# EAGLE design GBP USB-C Charging Kit (EAGLE 6.2)
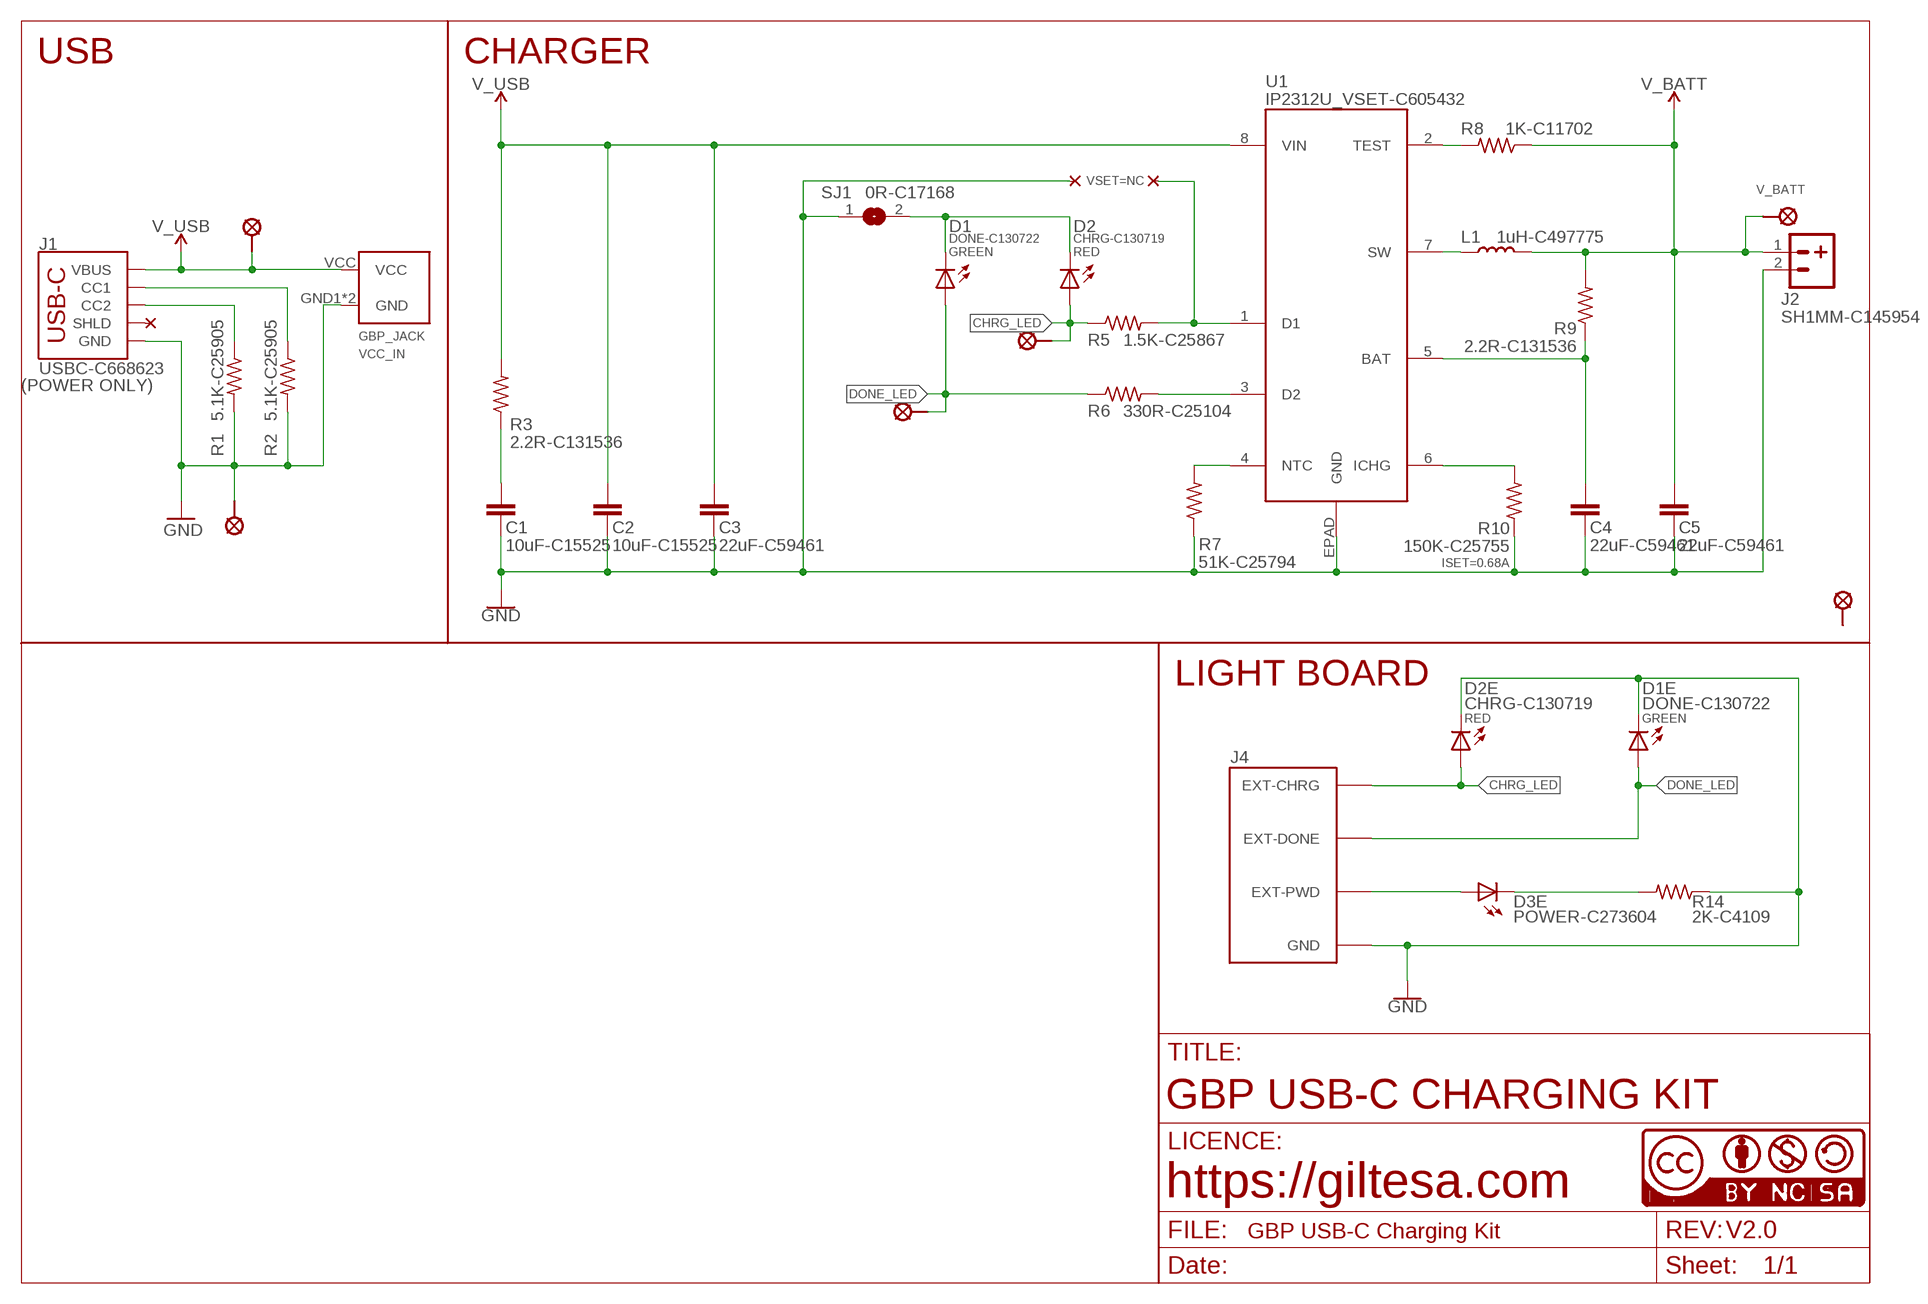
[diagram p0: schematic, sheet 1]

## Parts
C1  10uF-C15525  C0402_S  [C0402_S]
C2  10uF-C15525  C0402_S  [C0402_S]
C3  22uF-C59461  C0603_SMALL  [C0603_S]
C4  22uF-C59461  C0603_SMALL  [C0603_S]
C5  22uF-C59461  C0603_SMALL  [C0603_S]
D1  DONE-C130722  LED_0402  [L0402]
D1E  DONE-C130722  LED_0402  [L0402]
D2  CHRG-C130719  LED_0402  [L0402]
D2E  CHRG-C130719  LED_0402  [L0402]
D3E  POWER-C273604  LED_0402  [L0402]
GBP_JACK  VCC_IN  GBP_POWER_JACK_DIP  [GBP_POWER_JACK_DIP]
J1  USBC-C668623  USB-C_6P_POWER  [USB-C_6P]
J2  SH1MM-C145954  JST-21MM  [JST-2-1MM-SMD_RIGHT]
J4  GBP_LED_V2  [GBP_LED_V2]
L1  1uH-C497775  INDUCTOR_2  [PSPMAA0402]
R1  5.1K-C25905  R0402  [R0402]
R2  5.1K-C25905  R0402  [R0402]
R3  2.2R-C131536  R0402  [R0402]
R5  1.5K-C25867  R0402  [R0402]
R6  330R-C25104  R0402  [R0402]
R7  51K-C25794  R0402  [R0402]
R8  1K-C11702  R0402  [R0402]
R9  2.2R-C131536  R0402  [R0402]
R10  150K-C25755  R0402  [R0402]
R14  2K-C4109  R0402  [R0402]
SJ1  0R-C17168  JUMPER-SMD0402  [JUMPER-SMD_0402]
U1  IP2312U_VSET-C605432  IP2312_CUSTOM  [IP2312]
U$1  V_BATT  PAD_1.25  [PAD_1.25]
U$2  SOLDER_PAD-2.0  [SOLDER_PAD_2.0]
U$12  PAD_2.0  [PAD_2.0]
U$17  CC-NC-BCNIX  [CC-NC-B_NIX]
U$24  CHRG_LED  SOLDER_PAD-1.3  [SOLDER_PAD_1.3]
U$25  DONE_LED  SOLDER_PAD-1.3  [SOLDER_PAD_1.3]
U$41  PAD_1.25  [PAD_1.25]

## Nets
CHRG_LED: D2.A D2E.A J4.EXT-CHRG R5.1 U$24.P$1
DONE_LED: D1.A D1E.A J4.EXT-DONE R6.1 U$25.P$1
GND: C1.1 C2.1 C3.1 C4.1 C5.1 D1E.C D2E.C GBP_JACK.GND1(GND) GBP_JACK.GND2(GND) J1.A12-GND(GND) J1.B12-GND(GND) J2.2 J4.GND R1.2 R2.2 R7.1 R10.1 R14.1 SJ1.1 U1.EPAD(GND) U$12.P$1
N$1: D1.C D2.C SJ1.2
N$4: J1.B5(CC2) R1.1
N$6: R8.2 U1.2(TEST)
N$10: D3E.A J4.EXT-PWD J4.EXT-PWD'(EXT-PWD)
N$11: D3E.C R14.2
N$13: J1.A5(CC1) R2.1
N$14: C4.2 R9.1 U1.5(BAT)
N$15: C1.2 R3.1
N$19: R5.2 U1.1(D1)
N$27: R7.2 U1.4(NTC)
N$28: R10.2 U1.6(ICHG)
N$29: R6.2 U1.3(D2)
N$31: L1.P$1 U1.7(SW)
V_BATT: C5.2 J2.1 L1.P$2 R8.1 R9.2 U$1.P$1
V_USB: C2.2 C3.2 GBP_JACK.VCC J1.A9-VBUS(VBUS) J1.B9-VBUS(VBUS) R3.2 U1.8(VIN) U$41.P$1
Unconnected: J1.SHLD1(SHLD) J1.SHLD2(SHLD) J1.SHLD3(SHLD) J1.SHLD4(SHLD) U$2.P$1

## Notes on the sheet
- USB | CHARGER
- VSET=NC
- GREEN | RED
- (POWER ONLY)
- ISET=0.68A
- LIGHT BOARD
- RED | GREEN
- GBP USB-C CHARGING KIT
- https://giltesa.com
- V2.0

## Library data of the parts
C1 C2 = ,giltesa:C0402
C3-C5 = ,giltesa:C0603
D1 D1E D2 D2E D3E = ,giltesa:LED
GBP_JACK = ,giltesa:GBP_POWER_JACK
J1 = ,giltesa:USB-C_6P
J2 = ,giltesa:JST-2
J4 = ,giltesa:GBP_LED_V2
L1 = ,giltesa:INDUCTOR
R1-R3 R5-R10 R14 = ,giltesa:R0402
SJ1 = ,giltesa:JUMPER-SMD
U1 = ,giltesa:IP2312
U$1 U$12 U$41 = ,giltesa:PAD
U$2 U$24 U$25 = ,giltesa:SOLDER_PAD
U$17 = cc-by-nc-sa:CC-NC-BC: All hardware is licensed under the Creative Commons Attribution-Noncommercial-Share Alike 2.5 Switzerland License. To view a copy of this license, visit http://creativecommons.org/licenses/by-nc-sa/2.5/ch/ or send a letter to Creative Commons, 171 Second Street, Suite 300, San Francisco, California, 94105, USA.

## Net classes
1 power: width 0.61 mm, drill 0.406 mm, clearance 0.203 mm
2 gnd: width 0.305 mm, drill 0.406 mm, clearance 0.203 mm
3 power usb: width 0.508 mm, drill 0.406 mm, clearance 0.203 mm

## Board
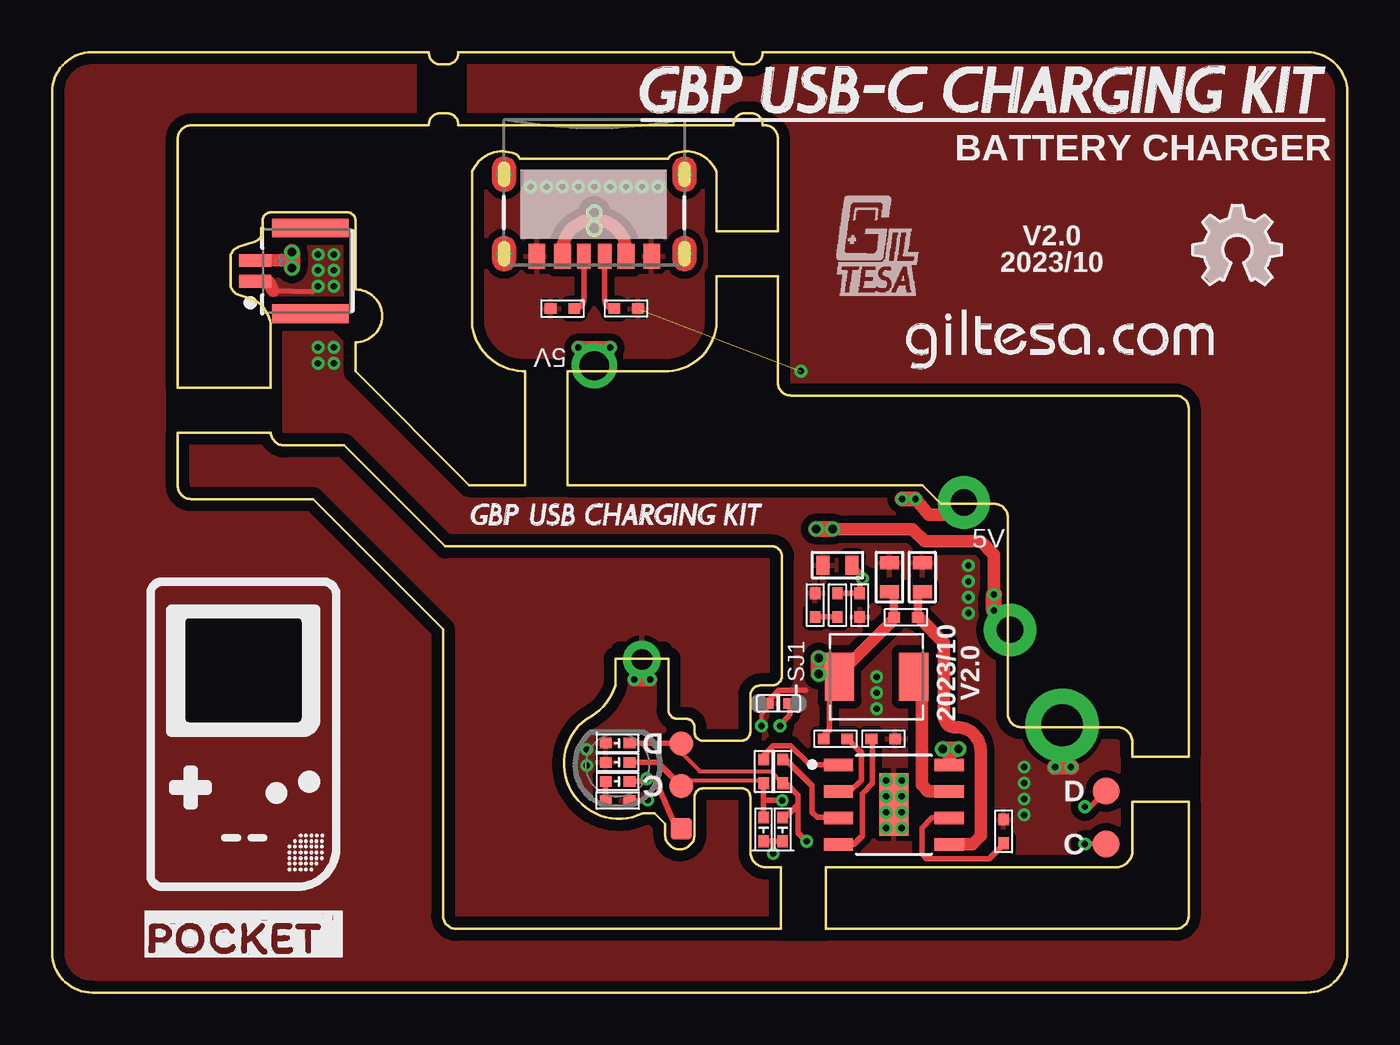
[diagram p1: board, top side]
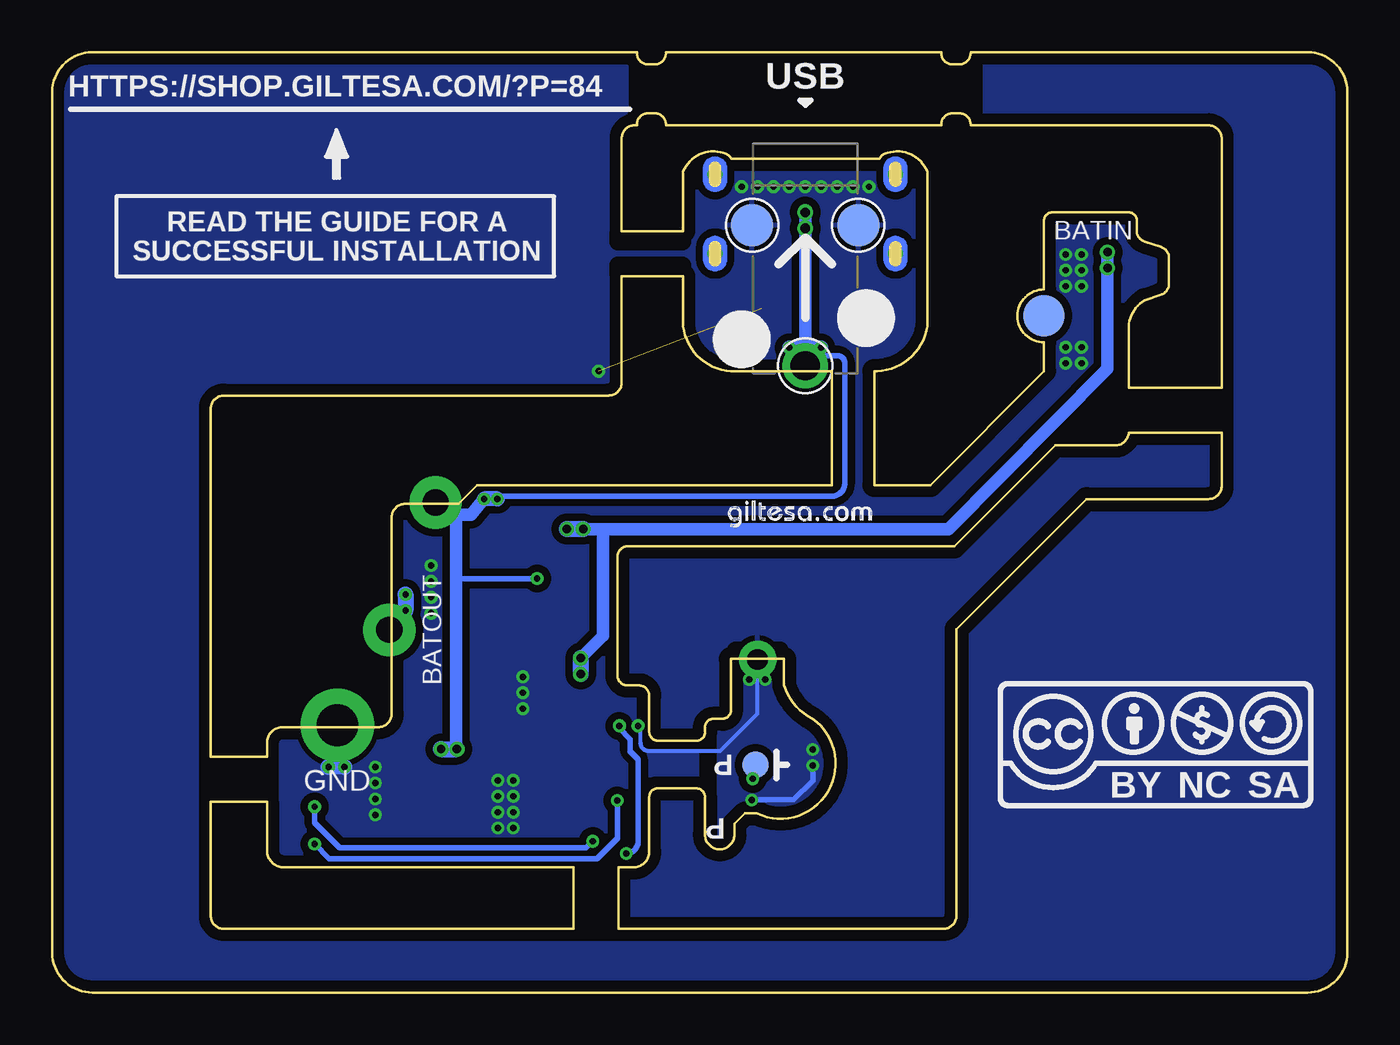
[diagram p2: board, bottom side, seen from below]

Size 62 x 45 mm. Coordinates in mm from the lower left corner, seen from the top.
Outline: 13.99,26.18 11.19,26.18 arc-90 10.46,26.79 6.01,26.79 6.01,24.25 arc90 6.64,23.62 12.49,23.62 18.71,17.39 18.71,3.68 arc90 19.35,3.04 34.89,3.04 34.89,5.99 34.18,5.99 arc-90 33.42,6.75 33.42,9.34 arc90 33.04,9.77 31.2,9.77 arc90 30.75,9.39 30.75,7.56 arc-180 29.34,7.56 29.34,8.07 28.83,8.57 28.27,8.57 arc-170 25.6,13.1 arc45 26.96,14.7 26.96,15.97 29.5,15.97 29.5,13.55 arc90 29.89,13.1 30.37,13.1 arc-90 30.75,12.66 30.75,12.51 arc90 31.12,12.05 32.98,12.05 arc90 33.42,12.45 33.42,14.19 arc-90 33.92,14.7 34.43,14.7 arc90 34.94,15.16 34.94,20.85 arc90 34.43,21.36 18.81,21.36 13.99,26.18
Outline: 19.95,24.28 14.52,29.74 14.52,31.11 arc180 14.52,33.65 14.52,36.95 arc90 14.14,37.33 10.46,37.33 arc90 10.07,36.95 10.07,36.32 arc-50 9.69,35.94 8.93,35.68 arc60 8.55,35.3 8.55,33.78 arc60 8.93,33.4 9.69,33.14 arc-50 10.46,32 10.46,28.95 6.01,28.95 6.01,40.87 arc-90 6.64,41.5 18.03,41.5 arc-90 18.55,42.08 18.93,42.08 arc-90 19.44,41.5 32.62,41.5 arc-90 33.12,42.08 33.51,42.08 arc-90 34.01,41.5 34.13,41.5 arc-90 34.74,40.87 34.74,36.45 31.79,36.45 31.79,39.3 arc90 29.74,40.14 arc40 29.49,39.9 22.4,39.9 arc40 22.16,40.14 arc90 20.11,39.3 20.11,31.9 arc80 22.52,29.74 22.65,29.74 22.65,24.28 19.95,24.28
Outline: 51.72,9.12 51.72,6.88 arc-90 50.96,5.99 37.05,5.99 37.05,3.04 53.78,3.04 arc90 54.41,3.68 54.41,9.12 51.72,9.12
Outline: 24.68,24.28 41.66,24.28 42.55,23.38 45.09,23.38 arc-90 45.75,22.75 45.75,13.34 arc90 46.38,12.7 50.96,12.7 arc-90 51.72,11.94 51.72,11.28 54.41,11.28 54.41,27.94 arc90 53.78,28.57 35.37,28.57 arc-90 34.74,29.21 34.74,34.29 31.79,34.29 31.79,31.9 arc-80 29.5,29.74 24.68,29.74 24.68,24.28
Outline: 1.91,0 60.07,0 arc90 62,1.91 62,43.1 arc90 60.07,45 34.01,45 arc-90 33.51,44.42 33.12,44.42 arc-90 32.62,45 19.44,45 arc-90 18.93,44.42 18.55,44.42 arc-90 18.03,45 1.91,45 arc90 0,43.1 0,1.91 arc90 1.91,0
Copper layers (1*16): Top 0.035mm / dielectric 1.6mm / Bottom 0.035mm
Design rules: minimum track width 6mil, minimum drill 12mil, track to track 6mil, track to pad 6mil, pad to pad 6mil, via to via 8mil, smd to smd 0mil, copper to edge 20mil, drill to drill 10mil, minimum pad ring 6mil, minimum via ring 6mil, stop-mask expansion 0mil, vias tented up to drill 100mil, thermal gap 10mil
tRestrict: 17 lines
bRestrict: 19 lines

### Footprints (pad centres in the part's own frame; a part is rotated, then mirrored left to right if it is on the bottom)
C0402_S = smd 0.559 x 0.5: 1 -0.567,0; 2 0.567,0
C0603_S = smd 0.635 x 0.9: 1 -0.694,0; 2 0.694,0
L0402 = smd 0.559 x 0.5: A 0.567,0; C -0.567,0
GBP_POWER_JACK_DIP = smd 2.032 x 2.032 bottom: GND1 -2.54,1.905; GND2 2.54,1.905 | drill 1.397 pad 2.159: VCC 0,8.636
USB-C_6P = smd 0.635 x 1.2: A5 -0.5,2.034; B5 0.5,2.034 | smd 0.8 x 1.2: A9-VBUS 1.52,2.034; A12-GND 2.75,2.034; B9-VBUS -1.52,2.034; B12-GND -2.75,2.034 | drill 0.4 pad 0.6: SHLD1 -4.318,1.9; SHLD2 4.32,1.9; SHLD3 -4.318,-1.9; SHLD4 4.32,-1.9
JST-2-1MM-SMD_RIGHT = smd 0.6 x 1.524: 1 -0.5,-2.017; 2 0.5,-2.017 | smd 0.889 x 3.683: NC1 -2.054,0.635; NC2 2.054,0.635
GBP_LED_V2 = smd 1.143 x 1.143: EXT-CHRG -3.048,1.016; EXT-DONE -3.048,-1.016 | smd 1.27 x 1.27 bottom: EXT-PWD -1.27,0 | smd 1.016 x 1.016: EXT-PWD' -3.048,3.048 | drill 1 pad 1.8: GND -1.166,-5.048
PSPMAA0402 = smd 1.4 x 2.3: P$1 -1.775,0; P$2 1.775,0
R0402 = smd 0.559 x 0.5: 1 -0.567,0; 2 0.567,0
JUMPER-SMD_0402 = smd 0.635 x 0.5: 1 -0.559,0; 2 0.559,0
IP2312 = smd 1.4 x 0.6: 1 -2.65,1.905; 2 -2.65,0.635; 3 -2.65,-0.635; 4 -2.65,-1.905; 5 2.65,-1.905; 6 2.65,-0.635; 7 2.65,0.635; 8 2.65,1.905 | smd 1.4 x 3: EPAD 0,0
PAD_1.25 = drill 1.25 pad 2.5: P$1 0,0
SOLDER_PAD_2.0 = smd 2 x 2: P$1 0,0
PAD_2.0 = drill 2 pad 3.5: P$1 0,0
SOLDER_PAD_1.3 = smd 1.3 x 1.3: P$1 0,0

### Placement (x,y rotation side)
C1  36.53,18.54 270 top
C2  38.66,18.54 90 top
C3  37.59,20.45 0 top
C4  41.65,19.88 270 top
C5  40.08,19.88 270 top
D1  34.97,7.8 90 top
D1E  27.07,11.93 0 top
D2  34.06,7.8 90 top
D2E  27.07,11.02 0 top
D3E  27.07,10.1 0 top
GBP_JACK  25.95,38.63 180 top
J1  25.95,37.27 180 top
J2  11.73,34.54 270 top
J4  27.07,10.89 180 top
L1  39.47,15.11 180 top
LOGO1  OSHW_LOGO_FILLX0150-NT  [OSHW_FILLX150_NOTEXT]  54.61,33.87 0 top
R1  24.43,32.73 180 top
R2  27.47,32.73 0 top
R3  37.59,18.54 90 top
R5  34.06,10.58 90 top
R6  34.97,10.58 90 top
R7  39.78,12.14 180 top
R8  37.5,12.14 0 top
R9  40.87,17.96 180 top
R10  45.55,7.71 270 top
R14  27.07,9.19 180 top
SJ1  34.77,13.83 0 top
U1  40.29,8.99 0 top
U$1  45.86,17.35 0 top
U$2  14.53,32.38 0 bottom
U$3  CC-BY-NC-SA15MM  [CC-BY-NC-SA_15MM]  16.74,8.82 0 bottom
U$4  [GBP_FRAME]  28.19,42.04 0 top
U$7  [GBP_FRAME_LOGO]  4.42,1.68 0 top
U$10  GILTESA.COM_MASK  [GILTESA.COM_MASK]  40.77,29.75 0 top
U$11  [GAME_BOY_POCKET_USB_CHARGING_KIT_NON]  19.94,22.35 0 top
U$12  48.35,12.79 0 top
U$13  [GILTESA_LOGO_MASK_5MM]  37.08,33.27 0 top
U$17  0,0 0 top
U$19  [GILTESA.COM_MASK_7MM]  29.69,22.2 0 bottom
U$24  50.45,7.11 0 top
U$25  50.45,9.65 0 top
U$41  43.64,23.45 0 top

### Tracks (layer width: path | path; a pad name or v marks a point on that pad's centre or on a via)
CHRG_LED  (via drill 0.3)
  Top 0.203: R5.1 33.95,10.16 30.4,10.16 J4.EXT-CHRG
  Top 0.254: D2E.A 28.97,11.02 J4.EXT-CHRG 30.37,9.88 | D2.A 34.06,9.19 | 34.06,9.19 v34.95,9.19 | R5.1 34.06,9.19 | v49.44,7.11 U$24.P$1
  Bottom 0.254: v34.95,9.19 34.95,7.39 35.92,6.41 48.74,6.41 v49.44,7.11
DONE_LED  (via drill 0.3)
  Top 0.203: R6.1 34.4,10.58 31,10.58 30.11,11.47 J4.EXT-DONE
  Top 0.254: D1E.A 30.09,11.93 J4.EXT-DONE 30.11,11.72 | D1.A 35.09,8.37 35.71,8.99 | R6.1 35.15,10.01 35.71,9.45 35.71,8.99 | 35.71,8.99 35.71,7.64 v36.12,7.24 | v49.44,8.89 49.69,8.89 U$25.P$1
  Bottom 0.254: v36.12,7.24 36.43,6.92 48.23,6.92 49.44,8.13 v49.44,8.89
GND  (via drill 0.3)  (1 unrouted)
  Top 0.203: v33.96,12.76 33.96,13.33 34.21,13.58 34.21,13.71
  Top 0.254: R14.1 28.49,9.19 v28.51,9.21 | J2.2 10.33,34.04 | 10.58,33.59 12.45,33.53 v12.73,33.8 | 34.21,13.71 34.21,13.89 34.8,14.48 36.07,14.48
  Top 0.61: 10.33,34.04 10.58,33.59
  Top 0.66: v27.86,14.99 v28.62,14.99
  Top 0.762: v48.77,10.79 v48.01,10.79
  Bottom 0.203: 28.24,15.93 28.24,13.34 30.02,11.56 33.45,11.56 arc90 33.83,11.94 33.83,12.7 v33.96,12.76
  Bottom 0.254: v28.51,9.21 26.52,9.21 25.59,10.14 v25.59,10.87 | 28.24,15.93 J4.GND
  Bottom 0.762: v48.01,10.79 v48.77,10.79
  other vias: 35.84,29.74 25.95,38.56 25.19,38.56 24.43,38.56 23.66,38.56 26.71,38.56 27.47,38.56 28.24,38.56 22.9,38.56 29,38.56 25.59,11.63 12.73,35.33 13.49,35.33 13.49,34.56 12.73,34.56 13.49,33.8 39.93,10.15 40.66,10.15 39.93,9.39 39.93,8.63 40.66,9.39 40.66,8.63 13.49,30.88 12.73,30.88 12.73,30.12 13.49,30.12 43.86,20.44 43.86,19.68 43.86,18.92 43.86,18.16 39.93,7.87 40.66,7.87 39.47,15.11 39.47,14.35 39.47,13.58 46.53,8.5 46.53,9.27 46.53,10.03 46.53,10.79
  pour Top (isolate 0.356): -1,46 63,46 63,-1 -1,-1
  pour Bottom (isolate 0.356): -1,46 63,46 63,-1 -1,-1
N$1  (via drill 0.3)
  Top 0.254: D1.C 34.51,7.24 | D2.C 34.51,7.24 | 34.51,7.24 v34.51,6.66 | SJ1.2 35.33,13.31 v34.85,12.76
  Bottom 0.254: v34.85,12.76 34.85,12.64 34.34,12.13 34.34,11.56 33.96,11.18 33.96,7.21 arc90 v34.51,6.66
N$4
  Top 0.254: J1.B5 25.45,33.19 arc-90 R1.1
N$6
  Top 0.254: U1.2 38.2,9.63 38.73,10.16 38.73,11.48 R8.2
N$10  (via drill 0.3)
  Top 0.254: D3E.A 28.34,10.11 v28.46,10.23 28.8,10.23 28.88,10.16 29.77,8.13 J4.EXT-PWD'
  Bottom 0.254: J4.EXT-PWD v28.46,10.23
N$11
  Top 0.254: R14.2 D3E.C
N$13
  Top 0.254: J1.A5 26.45,33.19 arc90 R2.1
N$14
  Top 0.254: 42.69,16.72 42.69,16.75 | R9.1 41.55,17.96 41.58,17.86 | 41.44,18.97 C4.2
  Top 0.406: R9.1 41.44,18.97
  Top 0.61: U1.5 44.04,7.09 44.45,7.49 44.45,11.56 arc90 43.31,12.7 43.2,12.7 arc-90 42.7,13.21 arc90 42.69,13.22 42.69,16.72 | 42.69,16.75 41.58,17.86
N$15
  Top 0.254: C1.2 R3.1
N$19
  Top 0.254: R5.2 34.06,11.33 34.54,11.81 35.35,11.81 36.27,10.9 U1.1
N$27
  Top 0.254: U1.4 38.38,7.09 38.78,7.49 38.78,9.53 39.27,10.01 39.27,12.07 R7.2
N$28
  Top 0.254: U1.6 42.11,8.36 41.63,7.87 41.63,6.63 41.85,6.41 44.88,6.41 45.55,7.08 R10.2
N$29
  Top 0.254: R6.2 35.13,11.15 36.37,9.91 36.37,8.64 36.62,8.38 37.62,8.38 U1.3
N$31
  Top 0.61: L1.P$1 41.63,15.11 41.63,9.93 41.94,9.63 U1.7
V_BATT  (via drill 0.3, 0.41)
  Top 0.254: R8.1 36.93,12.29 37.21,12.57 37.21,14.63 L1.P$2 | 40.3,18.97 C5.2
  Top 0.406: R9.2 40.3,18.97
  Top 0.508: R9.2 40.15,17.72
  Top 0.599: J2.1 11.24,35.04
  Top 0.61: 11.24,35.04 v11.48,34.67 | v45.09,19.05 45.09,20.95 44.45,21.59 41.78,21.59 41.19,22.18 v37.37,22.18 | U$1.P$1 45.86,17.52 v45.09,18.29 | 40.15,17.72 37.69,15.27 L1.P$2
  Top 0.762: v11.48,35.43 v11.48,34.67 | v36.7,15.24 v36.7,16 37.59,15.11 L1.P$2 | v37.37,22.18 v36.58,22.18 | v45.09,18.29 v45.09,19.05
  Bottom 0.61: v11.48,35.43 11.48,29.84 19.1,22.18 35.56,22.18 | 35.56,22.18 v36.58,22.18 | v36.7,16 35.64,17.07 35.64,22.1 35.56,22.18
  Bottom 0.762: v36.7,16 v36.7,15.24 | v36.58,22.18 v37.37,22.18 | v45.09,19.05 v45.09,18.29
V_USB  (via drill 0.3, 0.41, 0.46)
  Top 0.254: 42.85,11.79 v42.62,11.65 | R3.2 C2.2 38.66,19.81 | U1.8 42.94,11.03 | 38.66,19.81 38.66,20.08 C3.2 | v38.79,19.81 38.66,19.81
  Top 0.61: 25.96,36.96 arc90 24.43,35.56 J1.A9-VBUS | J1.B9-VBUS 27.47,35.57 arc90 25.96,36.96 | 25.95,36.96 25.96,36.96 | 43.04,11.71 v43.38,11.65 | 41.27,23.62 v41.33,23.62 41.96,22.86 42.67,22.86 43.14,23.32 43.51,23.32 U$41.P$1 | 42.94,11.03 42.94,11.65 v42.62,11.65
  Top 0.66: v25.19,30.86 v26.72,30.86
  Top 0.711: v40.69,23.62 41.27,23.62 v41.32,23.62
  Top 0.762: v25.95,37.34 25.95,36.96 | v42.62,11.65 v43.38,11.65
  Top 0.813: v25.95,37.34 v25.95,36.58
  Bottom 0.254: 25.95,30.22 25.81,30.48 | 25.81,30.48 24.43,30.48 arc90 24.05,30.1 24.05,24.38 arc90 24.69,23.75 40.56,23.75 v40.69,23.62 | 25.81,30.48 25.95,29.97 GBP_JACK.VCC | v38.79,19.81 42.67,19.81
  Bottom 0.61: 42.67,22.86 43.14,23.32 43.51,23.32 U$41.P$1 | 42.67,22.86 41.96,22.86 v41.32,23.62 | 42.67,22.86 42.73,22.92 | 42.67,22.86 | 42.67,22.86 42.67,19.81 42.67,11.65 v42.62,11.65 | v25.95,37.34 25.95,30.86 GBP_JACK.VCC
  Bottom 0.66: v25.19,30.86 25.95,30.86 v26.72,30.86
  Bottom 0.711: v40.69,23.62 v41.32,23.62
  Bottom 0.762: v43.38,11.65 v42.62,11.65

### Text on the board
tPlace: BATTERY CHARGER | V2.0 | 2023/10 | 5V | 5V | SJ1 | 2023/10 | V2.0 | D | C
bPlace: USB | HTTPS://SHOP.GILTESA.COM/?P=84 | READ THE GUIDE FOR A | BATIN | SUCCESSFUL INSTALLATION | BATOUT | GND